# Altium schematic sheet Sheet.SchDoc
size 396 x 284 mm; SheetNumber: 1; SheetTotal: 1
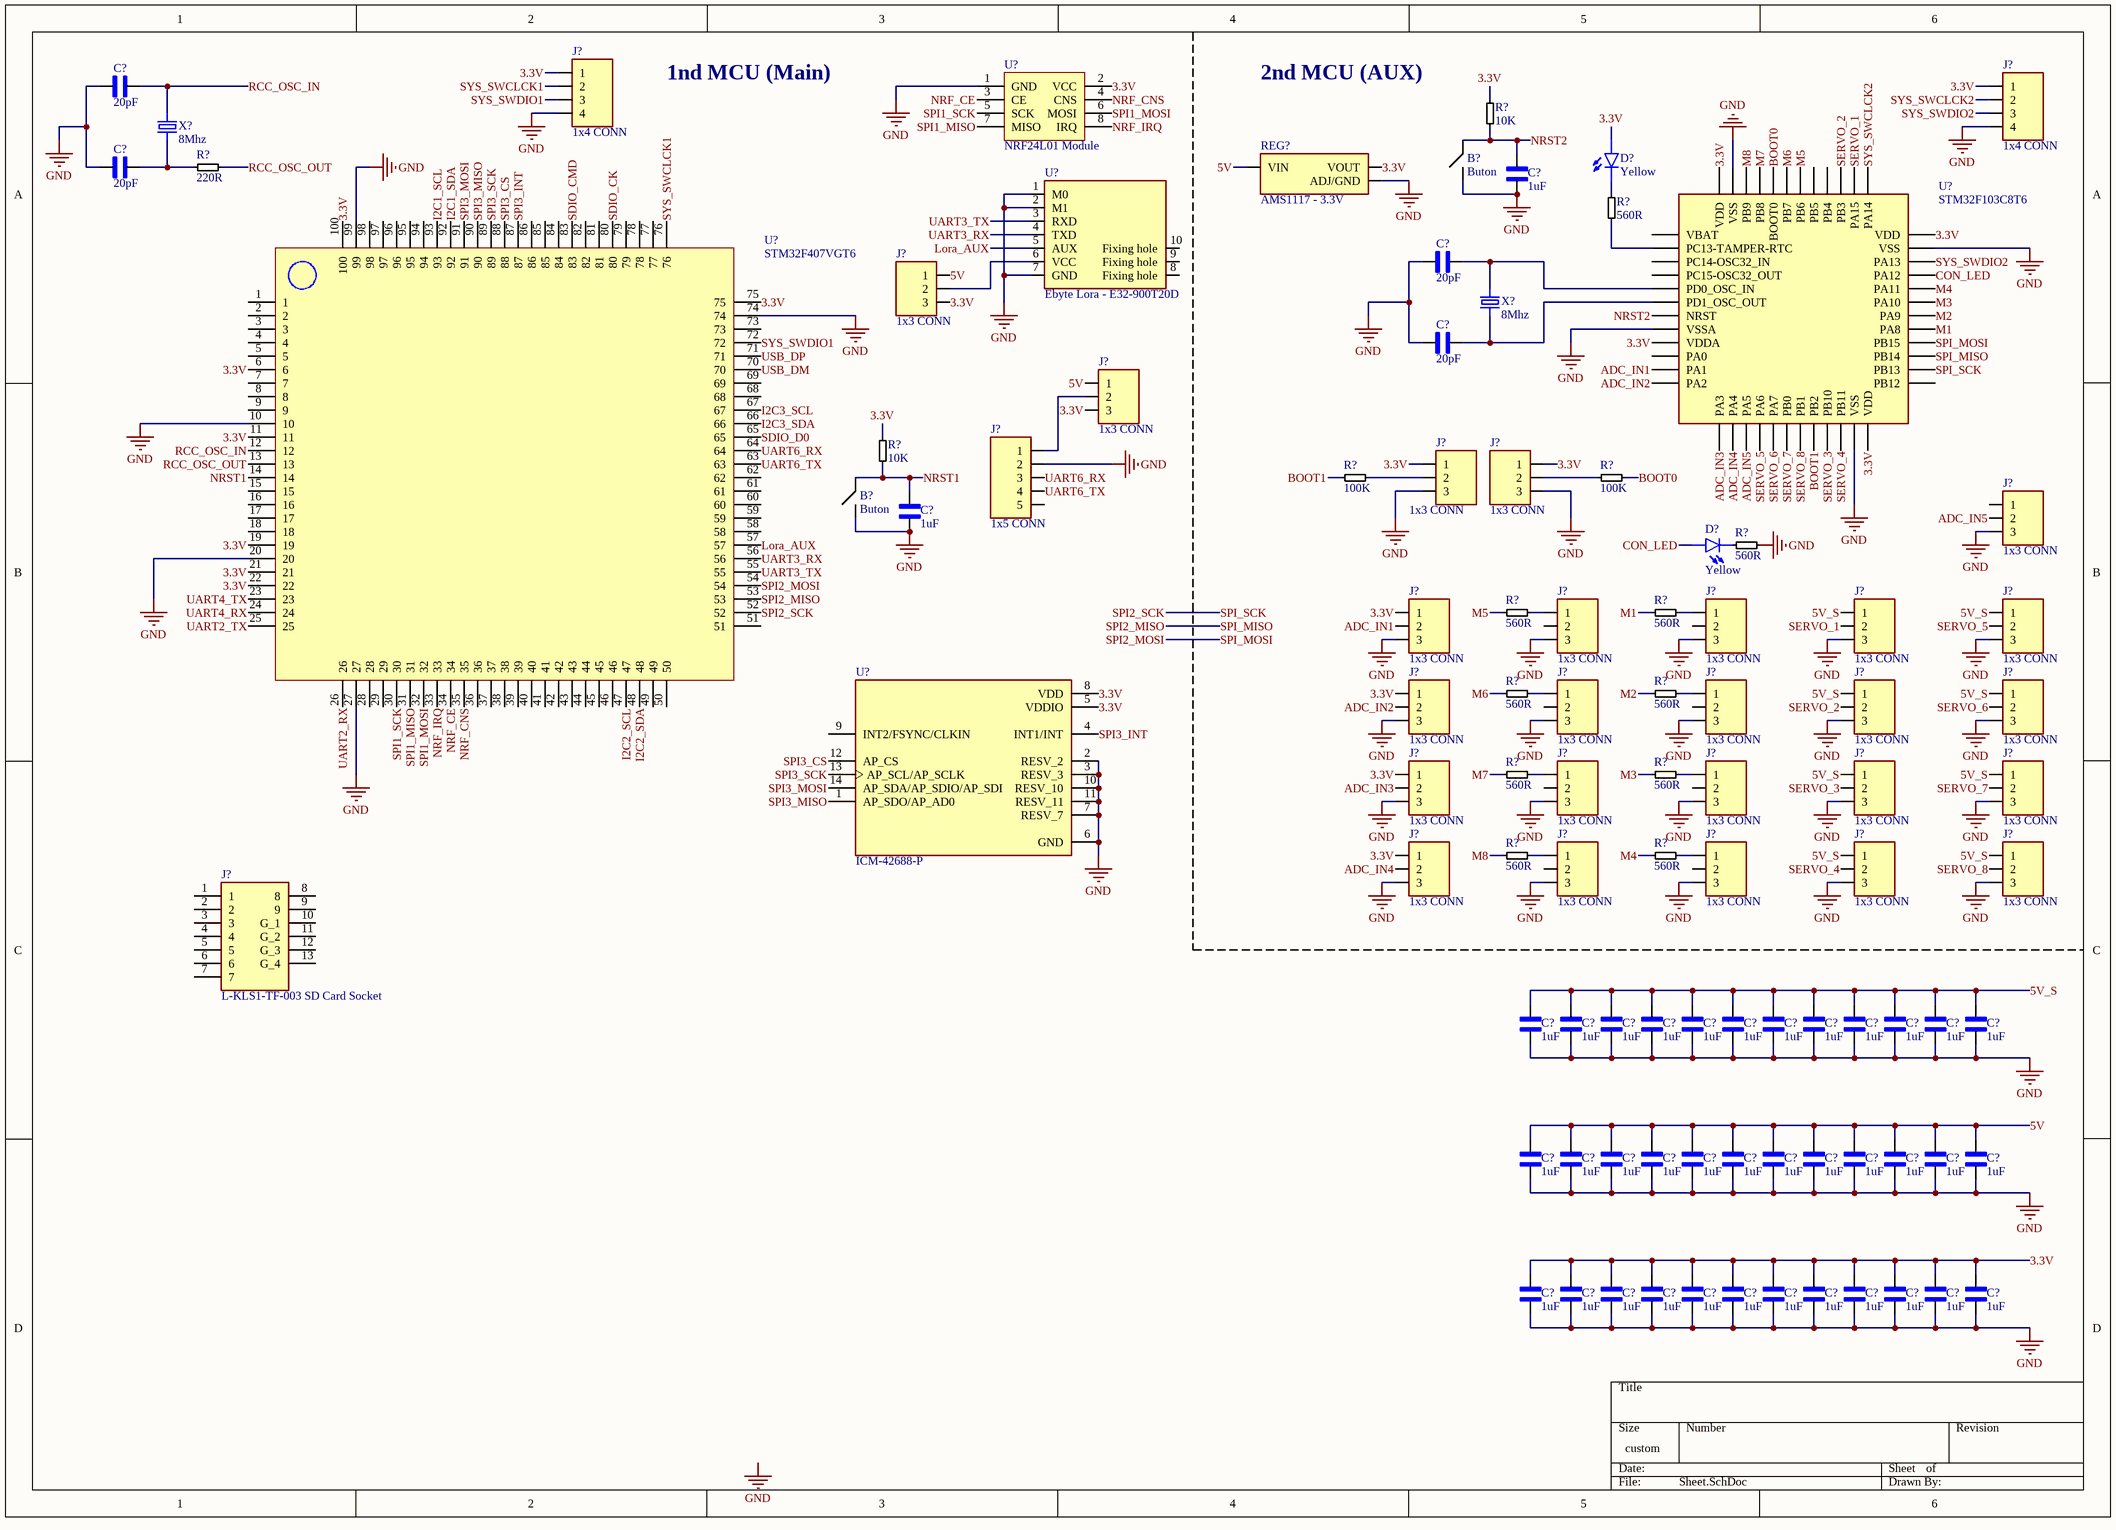
[diagram p0: Sheet.SchDoc]

## Parts
(Parts that share a designator on the sheet are numbered #1, #2 ... from top to bottom, then left to right.)
B?#1  Buton  [SMD TACT SWITCH BUTTON]
B?#2  Buton  [SMD TACT SWITCH BUTTON]
C?#1  20pF  [0603 SMD CAP]
C?#2  20pF  [0603 SMD CAP]
C?#3  1uF  [0603 SMD CAP]
C?#4  20pF  [0603 SMD CAP]
C?#5  20pF  [0603 SMD CAP]
C?#6  1uF  [0603 SMD CAP]
C?#7  1uF  [0603 SMD CAP]
C?#8  1uF  [0603 SMD CAP]
C?#9  1uF  [0603 SMD CAP]
C?#10  1uF  [0603 SMD CAP]
C?#11  1uF  [0603 SMD CAP]
C?#12  1uF  [0603 SMD CAP]
C?#13  1uF  [0603 SMD CAP]
C?#14  1uF  [0603 SMD CAP]
C?#15  1uF  [0603 SMD CAP]
C?#16  1uF  [0603 SMD CAP]
C?#17  1uF  [0603 SMD CAP]
C?#18  1uF  [0603 SMD CAP]
C?#19  1uF  [0603 SMD CAP]
C?#20  1uF  [0603 SMD CAP]
C?#21  1uF  [0603 SMD CAP]
C?#22  1uF  [0603 SMD CAP]
C?#23  1uF  [0603 SMD CAP]
C?#24  1uF  [0603 SMD CAP]
C?#25  1uF  [0603 SMD CAP]
C?#26  1uF  [0603 SMD CAP]
C?#27  1uF  [0603 SMD CAP]
C?#28  1uF  [0603 SMD CAP]
C?#29  1uF  [0603 SMD CAP]
C?#30  1uF  [0603 SMD CAP]
C?#31  1uF  [0603 SMD CAP]
C?#32  1uF  [0603 SMD CAP]
C?#33  1uF  [0603 SMD CAP]
C?#34  1uF  [0603 SMD CAP]
C?#35  1uF  [0603 SMD CAP]
C?#36  1uF  [0603 SMD CAP]
C?#37  1uF  [0603 SMD CAP]
C?#38  1uF  [0603 SMD CAP]
C?#39  1uF  [0603 SMD CAP]
C?#40  1uF  [0603 SMD CAP]
C?#41  1uF  [0603 SMD CAP]
C?#42  1uF  [0603 SMD CAP]
D?#1  Yellow  [0603 SMD LED]
D?#2  Yellow  [0603 SMD LED]
J?#1  1x4 CONN  [CON1x4_2.54MM]
J?#2  1x4 CONN  [CON1x4_2.54MM]
J?#3  1x3 CONN  [CON1x3_2.54MM]
J?#4  1x3 CONN  [CON1x3_2.54MM]
J?#5  1x5 CONN  [CON1x5_2.54MM]
J?#6  1x3 CONN  [CON1x3_2.54MM]
J?#7  1x3 CONN  [CON1x3_2.54MM]
J?#8  1x3 CONN  [CON1x3_2.54MM]
J?#9  1x3 CONN  [CON1x3_2.54MM]
J?#10  1x3 CONN  [CON1x3_2.54MM]
J?#11  1x3 CONN  [CON1x3_2.54MM]
J?#12  1x3 CONN  [CON1x3_2.54MM]
J?#13  1x3 CONN  [CON1x3_2.54MM]
J?#14  1x3 CONN  [CON1x3_2.54MM]
J?#15  1x3 CONN  [CON1x3_2.54MM]
J?#16  1x3 CONN  [CON1x3_2.54MM]
J?#17  1x3 CONN  [CON1x3_2.54MM]
J?#18  1x3 CONN  [CON1x3_2.54MM]
J?#19  1x3 CONN  [CON1x3_2.54MM]
J?#20  1x3 CONN  [CON1x3_2.54MM]
J?#21  1x3 CONN  [CON1x3_2.54MM]
J?#22  1x3 CONN  [CON1x3_2.54MM]
J?#23  1x3 CONN  [CON1x3_2.54MM]
J?#24  1x3 CONN  [CON1x3_2.54MM]
J?#25  1x3 CONN  [CON1x3_2.54MM]
J?#26  1x3 CONN  [CON1x3_2.54MM]
J?#27  1x3 CONN  [CON1x3_2.54MM]
J?#28  1x3 CONN  [CON1x3_2.54MM]
J?#29  L-KLS1-TF-003 SD Card Socket  [L-KLS1-TF-003-H1.85-R]
R?#1  10K  [0603 SMD RES]
R?#2  220R  [0603 SMD RES]
R?#3  560R  [0603 SMD RES]
R?#4  10K  [0603 SMD RES]
R?#5  100K  [0603 SMD RES]
R?#6  100K  [0603 SMD RES]
R?#7  560R  [0603 SMD RES]
R?#8  560R  [0603 SMD RES]
R?#9  560R  [0603 SMD RES]
R?#10  560R  [0603 SMD RES]
R?#11  560R  [0603 SMD RES]
R?#12  560R  [0603 SMD RES]
R?#13  560R  [0603 SMD RES]
R?#14  560R  [0603 SMD RES]
R?#15  560R  [0603 SMD RES]
REG?  AMS1117 - 3.3V  [SOT-223]
U?#1  NRF24L01 Module  [NRF24L01 MODULE]
U?#2  Ebyte Lora - E32-900T20D  [Ebyte LoRa Modul]
U?#3  STM32F103C8T6  [LQFP-48]
U?#4  STM32F407VGT6  [LQFP-100]
U?#5  ICM-42688-P  [LGA-14]
X?#1  8Mhz  [HC49-S Crystal Oscillator]
X?#2  8Mhz  [HC49-S Crystal Oscillator]

## Nets
GND: B?#1.0 B?#2.0 C?#1.2 C?#2.2 C?#3.2 C?#4.2 C?#5.2 C?#6.2 C?#7.2 C?#8.2 C?#9.2 C?#10.2 C?#11.2 C?#12.2 C?#13.2 C?#14.2 C?#15.2 C?#16.2 C?#17.2 C?#18.2 C?#19.2 C?#20.2 C?#21.2 C?#22.2 C?#23.2 C?#24.2 C?#25.2 C?#26.2 C?#27.2 C?#28.2 C?#29.2 C?#30.2 C?#31.2 C?#32.2 C?#33.2 C?#34.2 C?#35.2 C?#36.2 C?#37.2 C?#38.2 C?#39.2 C?#40.2 C?#41.2 C?#42.2 J?#1.4 J?#2.4 J?#5.2 J?#6.3 J?#7.3 J?#8.3 J?#9.3 J?#10.3 J?#11.3 J?#12.3 J?#13.3 J?#14.3 J?#15.3 J?#16.3 J?#17.3 J?#18.3 J?#19.3 J?#20.3 J?#21.3 J?#22.3 J?#23.3 J?#24.3 J?#25.3 J?#26.3 J?#27.3 J?#28.3 R?#7.2 REG?.1(ADJ/GND) U?#1.1(GND) U?#2.1(M0) U?#2.2(M1) U?#2.7(GND) U?#3.8(VSSA) U?#3.23(VSS) U?#3.35(VSS) U?#3.47(VSS) U?#4.10 U?#4.20 U?#4.27 U?#4.74 U?#4.99 U?#5.2(RESV_2) U?#5.3(RESV_3) U?#5.6(GND) U?#5.7(RESV_7) U?#5.10(RESV_10) U?#5.11(RESV_11)
3.3V: C?#31.1 C?#32.1 C?#33.1 C?#34.1 C?#35.1 C?#36.1 C?#37.1 C?#38.1 C?#39.1 C?#40.1 C?#41.1 C?#42.1 D?#1.A J?#1.1 J?#2.1 J?#3.3 J?#4.3 J?#6.1 J?#7.1 J?#9.1 J?#14.1 J?#19.1 J?#24.1 R?#1.1 R?#4.1 REG?.2(VOUT) U?#1.2(VCC) U?#3.9(VDDA) U?#3.24(VDD) U?#3.36(VDD) U?#3.48(VDD) U?#4.6 U?#4.11 U?#4.19 U?#4.21 U?#4.22 U?#4.75 U?#4.100 U?#5.5(VDDIO) U?#5.8(VDD)
5V: C?#19.1 C?#20.1 C?#21.1 C?#22.1 C?#23.1 C?#24.1 C?#25.1 C?#26.1 C?#27.1 C?#28.1 C?#29.1 C?#30.1 J?#3.1 J?#4.1 REG?.3(VIN)
5V_S: C?#7.1 C?#8.1 C?#9.1 C?#10.1 C?#11.1 C?#12.1 C?#13.1 C?#14.1 C?#15.1 C?#16.1 C?#17.1 C?#18.1 J?#12.1 J?#13.1 J?#17.1 J?#18.1 J?#22.1 J?#23.1 J?#27.1 J?#28.1
ADC_IN1: J?#9.2 U?#3.11(PA1)
ADC_IN2: J?#14.2 U?#3.12(PA2)
ADC_IN3: J?#19.2 U?#3.13(PA3)
ADC_IN4: J?#24.2 U?#3.14(PA4)
ADC_IN5: J?#8.2 U?#3.15(PA5)
BOOT0: R?#6.2 U?#3.44(BOOT0)
BOOT1: R?#5.1 U?#3.20(PB2)
CON_LED: D?#2.A U?#3.33(PA12)
I2C1_SCL: U?#4.93
I2C1_SDA: U?#4.92
I2C2_SCL: U?#4.47
I2C2_SDA: U?#4.48
I2C3_SCL: U?#4.67
I2C3_SDA: U?#4.66
Lora_AUX: U?#2.5(AUX) U?#4.57
M1: R?#9.1 U?#3.29(PA8)
M2: R?#11.1 U?#3.30(PA9)
M3: R?#13.1 U?#3.31(PA10)
M4: R?#15.1 U?#3.32(PA11)
M5: R?#8.1 U?#3.42(PB6)
M6: R?#10.1 U?#3.43(PB7)
M7: R?#12.1 U?#3.45(PB8)
M8: R?#14.1 U?#3.46(PB9)
NRF_CE: U?#1.3(CE) U?#4.34
NRF_CNS: U?#1.4(CNS) U?#4.35
NRF_IRQ: U?#1.8(IRQ) U?#4.33
NRST1: B?#2.1 C?#6.1 R?#4.2 U?#4.14
NRST2: B?#1.1 C?#3.1 R?#1.2 U?#3.7(NRST)
RCC_OSC_IN: C?#1.1 U?#4.12 X?#1.2
RCC_OSC_OUT: R?#2.2 U?#4.13
SDIO_CK: U?#4.80
SDIO_CMD: U?#4.83
SDIO_D0: U?#4.65
SERVO_1: J?#12.2 U?#3.38(PA15)
SERVO_2: J?#17.2 U?#3.39(PB3)
SERVO_3: J?#22.2 U?#3.21(PB10)
SERVO_4: J?#27.2 U?#3.22(PB11)
SERVO_5: J?#13.2 U?#3.16(PA6)
SERVO_6: J?#18.2 U?#3.17(PA7)
SERVO_7: J?#23.2 U?#3.18(PB0)
SERVO_8: J?#28.2 U?#3.19(PB1)
SPI1_MISO: U?#1.7(MISO) U?#4.31
SPI1_MOSI: U?#1.6(MOSI) U?#4.32
SPI1_SCK: U?#1.5(SCK) U?#4.30
SPI2_MISO: U?#3.27(PB14) U?#4.53  [also labelled SPI_MISO]
SPI2_MOSI: U?#3.28(PB15) U?#4.54  [also labelled SPI_MOSI]
SPI2_SCK: U?#3.26(PB13) U?#4.52  [also labelled SPI_SCK]
SPI3_CS: U?#4.88 U?#5.12(AP_CS)
SPI3_INT: U?#4.87 U?#5.4(INT1/INT)
SPI3_MISO: U?#4.90 U?#5.1(AP_SDO/AP_AD0)
SPI3_MOSI: U?#4.91 U?#5.14(AP_SDA/AP_SDIO/AP_SDI)
SPI3_SCK: U?#4.89 U?#5.13(AP_SCL/AP_SCLK)
SYS_SWCLCK1: J?#1.2 U?#4.76
SYS_SWCLCK2: J?#2.2 U?#3.37(PA14)
SYS_SWDIO1: J?#1.3 U?#4.72
SYS_SWDIO2: J?#2.3 U?#3.34(PA13)
UART2_RX: U?#4.26
UART2_TX: U?#4.25
UART3_RX: U?#2.4(TXD) U?#4.56
UART3_TX: U?#2.3(RXD) U?#4.55
UART4_RX: U?#4.24
UART4_TX: U?#4.23
UART6_RX: J?#5.3 U?#4.64
UART6_TX: J?#5.4 U?#4.63
USB_DM: U?#4.70
USB_DP: U?#4.71
NetC?#2_1: C?#2.1 R?#2.1 X?#1.1
NetC?#4_1: C?#4.1 U?#3.5(PD0_OSC_IN) X?#2.2
NetC?#5_1: C?#5.1 U?#3.6(PD1_OSC_OUT) X?#2.1
NetD?#1_C: D?#1.C R?#3.1
NetD?#2_C: D?#2.C R?#7.1
NetJ?#3_2: J?#3.2 U?#2.6(VCC)
NetJ?#4_2: J?#4.2 J?#5.1
NetJ?#6_2: J?#6.2 R?#5.2
NetJ?#7_2: J?#7.2 R?#6.1
NetJ?#10_1: J?#10.1 R?#8.2
NetJ?#11_1: J?#11.1 R?#9.2
NetJ?#15_1: J?#15.1 R?#10.2
NetJ?#16_1: J?#16.1 R?#11.2
NetJ?#20_1: J?#20.1 R?#12.2
NetJ?#21_1: J?#21.1 R?#13.2
NetJ?#25_1: J?#25.1 R?#14.2
NetJ?#26_1: J?#26.1 R?#15.2
NetR?#3_2: R?#3.2 U?#3.2(PC13-TAMPER-RTC)

Not connected (* = marked no-connect by the designer): J?#5 5; J?#8 1; J?#10 2; J?#11 2; J?#15 2; J?#16 2; J?#20 2; J?#21 2; J?#25 2; J?#26 2; J?#29 1 2 3 4 5 6 7 8 9 10(G_1) 11(G_2) 12(G_3) 13(G_4); U?#2 8(Fixing_hole) 9(Fixing_hole) 10(Fixing_hole); U?#3 1(VBAT) 3(PC14-OSC32_IN) 4(PC15-OSC32_OUT) 10(PA0) 25(PB12) 40(PB4) 41(PB5); U?#4 1 2 3 4 5 7 8 9 15 16 17 18 28 29 36 37 38 39 40 41 42 43 44 45 46 49 50 51 58 59 60 61 62 68 69 73 77 78 79 81 82 84 85 86 94 95 96 97 98; U?#5 9(INT2/FSYNC/CLKIN)

## Notes on the sheet
- 1nd MCU (Main)
- 2nd MCU (AUX)
- Labels drawn without touching a wire or pin: GND

## Library data of the parts
B?#1 B?#2 = SMD TACT SWITCH BUTTON
C?#1-C?#42 = CAP SMD 603
D?#1 D?#2 = LED 603 SMD
J?#1 J?#2 = CON1x4_2.54mm
J?#3 J?#4 J?#6-J?#28 = CON1x3_2.54mm
J?#5 = CON1x5_2.54mm
J?#29 = L-KLS1-TF-003-H1.85-R: L-KLS1-TF-003
R?#1 R?#4 = RES SMD 0603
R?#2 R?#3 R?#5-R?#15 = RES SMD 0603: 0603
REG? = AMS1117
U?#2 = Ebyte Lora
U?#5 = ICM42688-P
X?#1 X?#2 = HC49-S Crystal Oscillator